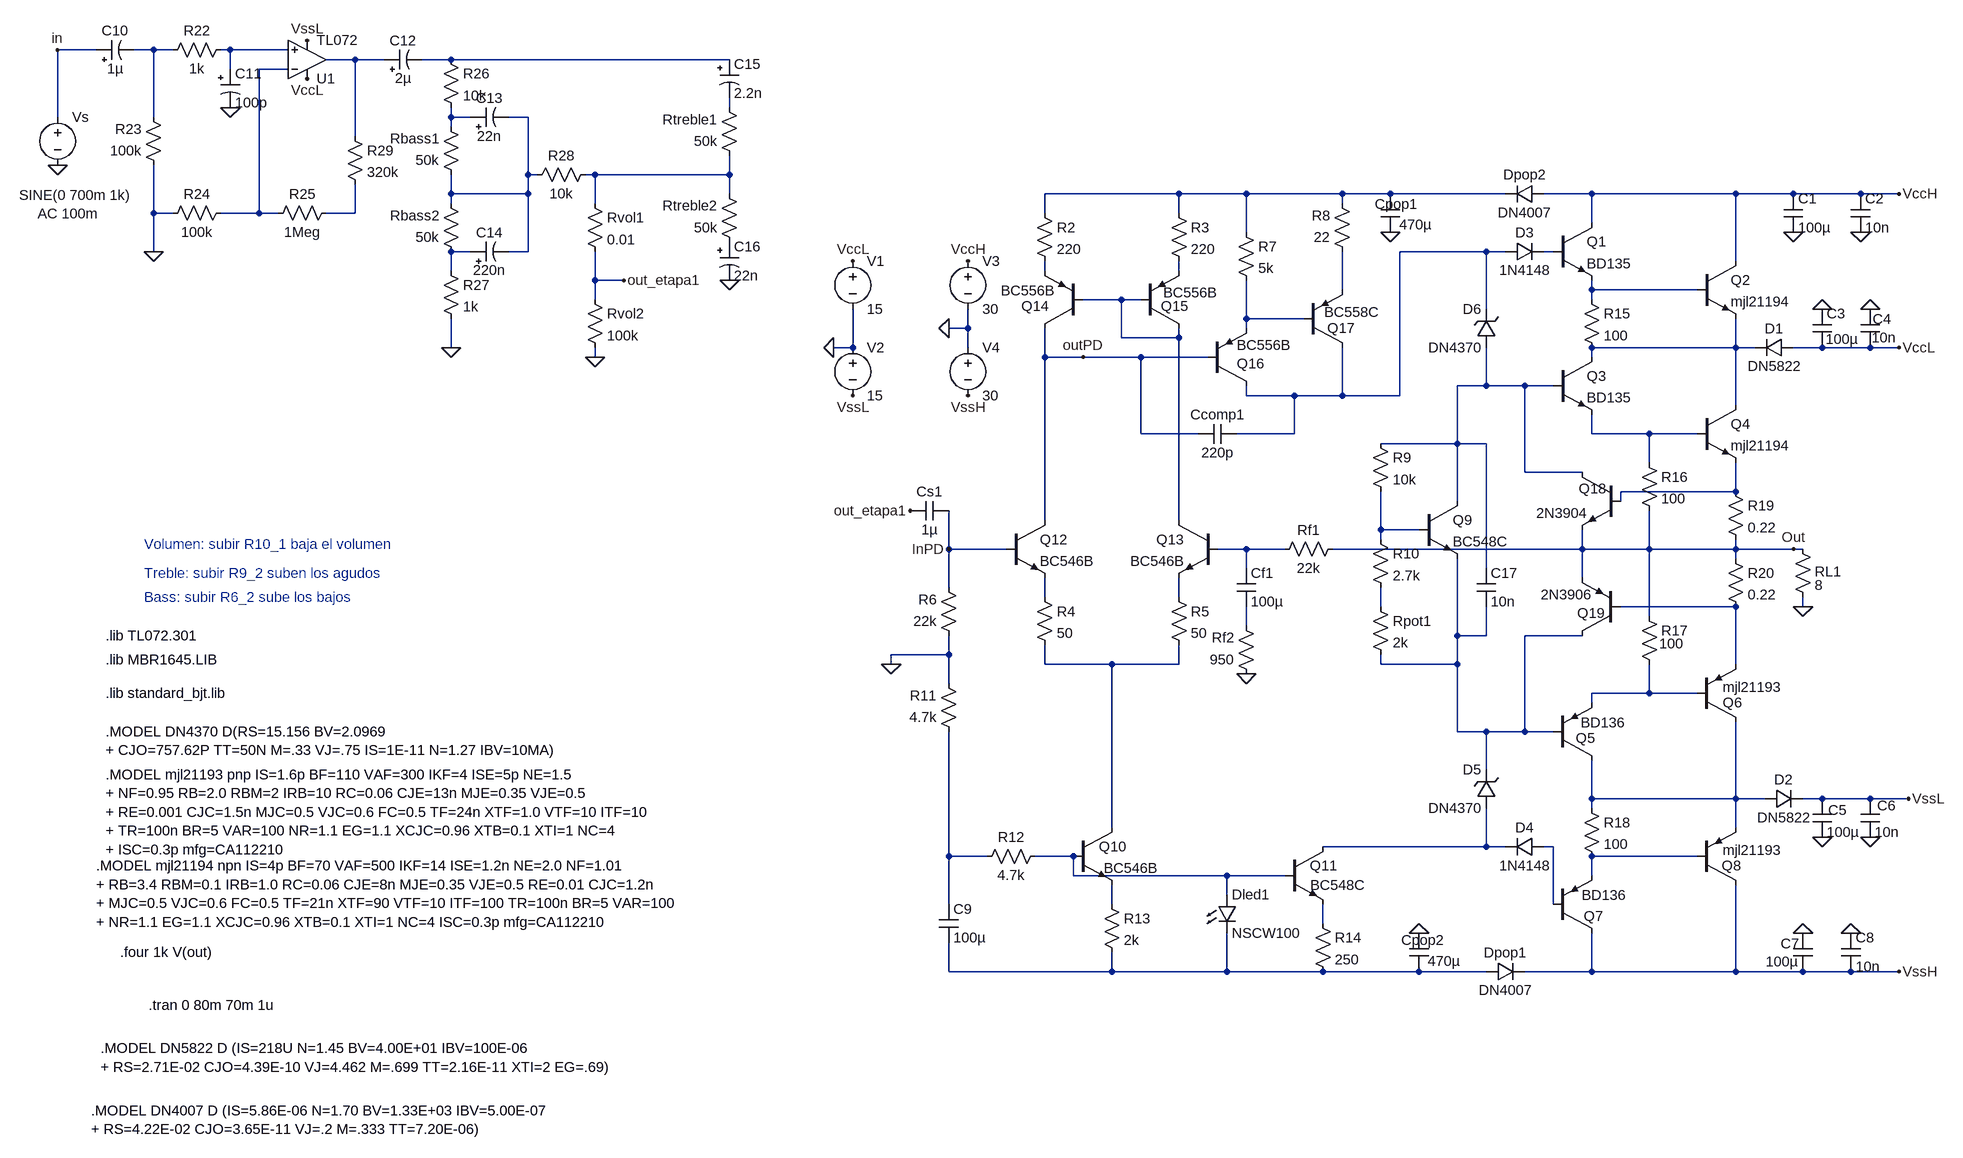
[diagram p0: schematic circuito_completo.asc]
circuito_completo.asc, the LTspice schematic file:
Version 4
SHEET 1 3596 1588
WIRE -736 -224 -800 -224
WIRE -640 -224 -672 -224
WIRE -608 -224 -640 -224
WIRE -512 -224 -528 -224
WIRE -416 -224 -512 -224
WIRE -304 -208 -352 -208
WIRE -256 -208 -304 -208
WIRE -144 -208 -192 -208
WIRE 320 -208 -144 -208
WIRE -512 -192 -512 -224
WIRE -416 -192 -464 -192
WIRE 320 -128 320 -144
WIRE -800 -112 -800 -224
WIRE -640 -112 -640 -224
WIRE -144 -112 -144 -128
WIRE -112 -112 -144 -112
WIRE -16 -112 -48 -112
WIRE -144 -96 -144 -112
WIRE -304 -80 -304 -208
WIRE -16 -16 -16 -112
WIRE 0 -16 -16 -16
WIRE 96 -16 80 -16
WIRE 320 -16 320 -48
WIRE 320 -16 96 -16
WIRE -144 16 -144 -16
WIRE -16 16 -16 -16
WIRE -16 16 -144 16
WIRE 320 16 320 -16
WIRE 1328 16 1104 16
WIRE 1440 16 1328 16
WIRE 1600 16 1440 16
WIRE 1680 16 1600 16
WIRE 1872 16 1680 16
WIRE 2016 16 1936 16
WIRE 2256 16 2016 16
WIRE 2352 16 2256 16
WIRE 2464 16 2352 16
WIRE 2528 16 2464 16
WIRE -144 32 -144 16
WIRE 96 32 96 -16
WIRE 1600 32 1600 16
WIRE -640 48 -640 -32
WIRE -608 48 -640 48
WIRE -464 48 -464 -192
WIRE -464 48 -528 48
WIRE -432 48 -464 48
WIRE -304 48 -304 0
WIRE -304 48 -352 48
WIRE 1104 48 1104 16
WIRE 1328 48 1328 16
WIRE 2016 64 2016 16
WIRE 1440 80 1440 16
WIRE -640 112 -640 48
WIRE -112 112 -144 112
WIRE -16 112 -16 16
WIRE -16 112 -48 112
WIRE 1840 112 1696 112
WIRE 1872 112 1840 112
WIRE 1952 112 1936 112
WIRE 2256 128 2256 16
WIRE -144 144 -144 112
WIRE 1104 144 1104 128
WIRE 1328 144 1328 128
WIRE 96 160 96 112
WIRE 144 160 96 160
WIRE 1600 176 1600 112
WIRE 2016 176 2016 160
WIRE 2192 176 2016 176
WIRE 96 192 96 160
WIRE 1232 192 1168 192
WIRE 1264 192 1232 192
WIRE 2016 192 2016 176
WIRE 1840 208 1840 112
WIRE 1440 224 1440 160
WIRE 1536 224 1440 224
WIRE 976 240 976 208
WIRE 976 240 944 240
WIRE 1440 240 1440 224
WIRE 1232 256 1232 192
WIRE 1328 256 1328 240
WIRE 1328 256 1232 256
WIRE -144 272 -144 224
WIRE 784 272 784 208
WIRE 784 272 752 272
WIRE 976 272 976 240
WIRE 2256 272 2256 224
WIRE 2256 272 2016 272
WIRE 2288 272 2256 272
WIRE 2400 272 2352 272
WIRE 2480 272 2400 272
WIRE 2528 272 2480 272
WIRE 96 288 96 272
WIRE 1104 288 1104 240
WIRE 1168 288 1104 288
WIRE 1264 288 1168 288
WIRE 1376 288 1264 288
WIRE 2016 288 2016 272
WIRE 1840 336 1840 272
WIRE 1840 336 1792 336
WIRE 1904 336 1840 336
WIRE 1952 336 1904 336
WIRE 1440 352 1440 336
WIRE 1520 352 1440 352
WIRE 1600 352 1600 272
WIRE 1600 352 1520 352
WIRE 1696 352 1696 112
WIRE 1696 352 1600 352
WIRE 2256 368 2256 272
WIRE 1264 416 1264 288
WIRE 1360 416 1264 416
WIRE 1520 416 1520 352
WIRE 1520 416 1424 416
WIRE 2016 416 2016 384
WIRE 2112 416 2016 416
WIRE 2192 416 2112 416
WIRE 1792 432 1792 336
WIRE 1792 432 1664 432
WIRE 1840 432 1792 432
WIRE 2112 464 2112 416
WIRE 1904 480 1904 336
WIRE 2000 480 1904 480
WIRE 2256 512 2256 464
WIRE 2256 512 2064 512
WIRE 1792 528 1792 432
WIRE 2064 528 2064 512
WIRE 1104 560 1104 288
WIRE 1328 560 1328 256
WIRE 1664 576 1664 512
WIRE 1728 576 1664 576
WIRE 1664 592 1664 576
WIRE 944 608 944 544
WIRE 1040 608 944 608
WIRE 1440 608 1392 608
WIRE 1504 608 1440 608
WIRE 2000 608 2000 576
WIRE 2000 608 1584 608
WIRE 2112 608 2112 544
WIRE 2112 608 2000 608
WIRE 2256 608 2256 592
WIRE 2256 608 2112 608
WIRE 2352 608 2256 608
WIRE 2368 608 2352 608
WIRE 2256 624 2256 608
WIRE 1440 640 1440 608
WIRE 1840 640 1840 432
WIRE 2000 656 2000 608
WIRE 944 672 944 608
WIRE 1104 688 1104 656
WIRE 1328 688 1328 656
WIRE 1664 704 1664 672
WIRE 2256 704 2064 704
WIRE 2368 704 2368 688
WIRE 2112 720 2112 608
WIRE 1440 736 1440 704
WIRE 1792 752 1792 624
WIRE 1840 752 1840 704
WIRE 1840 752 1792 752
WIRE 2000 752 1904 752
WIRE 944 784 944 752
WIRE 944 784 848 784
WIRE 848 800 848 784
WIRE 1104 800 1104 768
WIRE 1216 800 1104 800
WIRE 1328 800 1328 768
WIRE 1328 800 1216 800
WIRE 1664 800 1664 784
WIRE 1792 800 1792 752
WIRE 1792 800 1664 800
WIRE 2256 800 2256 704
WIRE 944 832 944 784
WIRE 2112 848 2112 800
WIRE 2112 848 2016 848
WIRE 2192 848 2112 848
WIRE 2016 864 2016 848
WIRE 1792 912 1792 800
WIRE 1840 912 1792 912
WIRE 1904 912 1904 752
WIRE 1904 912 1840 912
WIRE 1952 912 1904 912
WIRE 1840 976 1840 912
WIRE 2016 1024 2016 960
WIRE 2256 1024 2256 896
WIRE 2256 1024 2016 1024
WIRE 2304 1024 2256 1024
WIRE 2400 1024 2368 1024
WIRE 2480 1024 2400 1024
WIRE 2544 1024 2480 1024
WIRE 2016 1040 2016 1024
WIRE 1216 1072 1216 800
WIRE 2256 1072 2256 1024
WIRE 1840 1104 1840 1040
WIRE 1840 1104 1568 1104
WIRE 1872 1104 1840 1104
WIRE 1952 1104 1936 1104
WIRE 944 1120 944 912
WIRE 1008 1120 944 1120
WIRE 1152 1120 1088 1120
WIRE 2192 1120 2016 1120
WIRE 1152 1152 1152 1120
WIRE 1408 1152 1152 1152
WIRE 1504 1152 1408 1152
WIRE 2016 1152 2016 1120
WIRE 1408 1184 1408 1152
WIRE 944 1200 944 1120
WIRE 1216 1200 1216 1168
WIRE 1952 1200 1952 1104
WIRE 1568 1232 1568 1200
WIRE 944 1312 944 1264
WIRE 1216 1312 1216 1280
WIRE 1216 1312 944 1312
WIRE 1408 1312 1408 1248
WIRE 1408 1312 1216 1312
WIRE 1568 1312 1408 1312
WIRE 1728 1312 1568 1312
WIRE 1840 1312 1728 1312
WIRE 2016 1312 2016 1248
WIRE 2016 1312 1904 1312
WIRE 2256 1312 2256 1168
WIRE 2256 1312 2016 1312
WIRE 2368 1312 2256 1312
WIRE 2448 1312 2368 1312
WIRE 2528 1312 2448 1312
FLAG 752 272 0
FLAG 944 240 0
FLAG 976 128 VccH
FLAG 784 128 VccL
FLAG 976 352 VssH
FLAG 784 352 VssL
FLAG -800 -32 0
FLAG -144 272 0
FLAG -640 112 0
FLAG -384 -176 VccL
FLAG -384 -240 VssL
FLAG -512 -128 0
FLAG 96 288 0
FLAG 320 160 0
FLAG 144 160 out_etapa1
FLAG -800 -224 in
FLAG 2528 272 VccL
FLAG 2528 16 VccH
FLAG 2368 704 0
FLAG 2528 1312 VssH
FLAG 2352 608 Out
FLAG 1440 816 0
FLAG 848 800 0
FLAG 2544 1024 VssL
FLAG 944 608 InPD
FLAG 1680 80 0
FLAG 1728 1248 0
FLAG 2400 1088 0
FLAG 2368 1248 0
FLAG 2400 208 0
FLAG 2352 80 0
FLAG 2464 80 0
FLAG 2448 1248 0
FLAG 2480 208 0
FLAG 2480 1088 0
FLAG 1168 288 outPD
FLAG 880 544 out_etapa1
SYMBOL voltage 784 112 R0
WINDOW 123 0 0 Left 0
WINDOW 39 0 0 Left 0
SYMATTR InstName V1
SYMATTR Value 15
SYMBOL voltage 784 256 R0
WINDOW 123 0 0 Left 0
WINDOW 39 0 0 Left 0
SYMATTR InstName V2
SYMATTR Value 15
SYMBOL voltage 976 112 R0
WINDOW 123 0 0 Left 0
WINDOW 39 0 0 Left 0
SYMATTR InstName V3
SYMATTR Value 30
SYMBOL voltage 976 256 R0
WINDOW 123 0 0 Left 0
WINDOW 39 0 0 Left 0
SYMATTR InstName V4
SYMATTR Value 30
SYMBOL polcap -736 -208 R270
WINDOW 0 32 32 VTop 2
WINDOW 3 0 32 VBottom 2
SYMATTR InstName C10
SYMATTR Value 1µ
SYMBOL polcap -528 -192 R0
SYMATTR InstName C11
SYMATTR Value 100p
SYMBOL polcap -256 -192 R270
WINDOW 0 32 32 VTop 2
WINDOW 3 0 32 VBottom 2
SYMATTR InstName C12
SYMATTR Value 2µ
SYMBOL polcap -112 -96 R270
WINDOW 0 32 32 VTop 2
WINDOW 3 0 32 VBottom 2
SYMATTR InstName C13
SYMATTR Value 22n
SYMBOL polcap -112 128 R270
WINDOW 0 32 32 VTop 2
WINDOW 3 0 32 VBottom 2
SYMATTR InstName C14
SYMATTR Value 220n
SYMBOL polcap 304 -208 R0
SYMATTR InstName C15
SYMATTR Value 2.2n
SYMBOL polcap 304 96 R0
SYMATTR InstName C16
SYMATTR Value 22n
SYMBOL res -512 -240 R90
WINDOW 0 0 56 VBottom 2
WINDOW 3 32 56 VTop 2
SYMATTR InstName R22
SYMATTR Value 1k
SYMBOL res -624 -16 R180
WINDOW 0 36 76 Left 2
WINDOW 3 36 40 Left 2
SYMATTR InstName R23
SYMATTR Value 100k
SYMBOL res -624 64 R270
WINDOW 0 32 56 VTop 2
WINDOW 3 0 56 VBottom 2
SYMATTR InstName R24
SYMATTR Value 100k
SYMBOL res -448 64 R270
WINDOW 0 32 56 VTop 2
WINDOW 3 0 56 VBottom 2
SYMATTR InstName R25
SYMATTR Value 1Meg
SYMBOL res -160 -224 R0
SYMATTR InstName R26
SYMATTR Value 10k
SYMBOL res -128 128 R180
WINDOW 0 36 76 Left 2
WINDOW 3 36 40 Left 2
SYMATTR InstName Rbass2
SYMATTR Value 50k
SYMBOL res -160 128 R0
SYMATTR InstName R27
SYMATTR Value 1k
SYMBOL res 96 -32 R90
WINDOW 0 0 56 VBottom 2
WINDOW 3 32 56 VTop 2
SYMATTR InstName R28
SYMATTR Value 10k
SYMBOL res 336 -32 R180
WINDOW 0 36 76 Left 2
WINDOW 3 36 40 Left 2
SYMATTR InstName Rtreble1
SYMATTR Value 50k
SYMBOL res 80 16 R0
SYMATTR InstName Rvol1
SYMATTR Value 0.01
SYMBOL voltage -800 -128 R0
WINDOW 123 -33 177 Left 2
WINDOW 39 0 0 Left 0
WINDOW 3 -64 146 Left 2
SYMATTR Value2 AC 100m
SYMATTR Value SINE(0 700m 1k)
SYMATTR InstName Vs
SYMBOL Opamps\\opamp2 -384 -144 M180
SYMATTR InstName U1
SYMATTR Value TL072
SYMBOL res -128 0 R180
WINDOW 0 36 76 Left 2
WINDOW 3 36 40 Left 2
SYMATTR InstName Rbass1
SYMATTR Value 50k
SYMBOL res 336 112 R180
WINDOW 0 36 76 Left 2
WINDOW 3 36 40 Left 2
SYMATTR InstName Rtreble2
SYMATTR Value 50k
SYMBOL res 80 176 R0
SYMATTR InstName Rvol2
SYMATTR Value 100k
SYMBOL res 2352 592 R0
WINDOW 0 36 54 Left 2
SYMATTR InstName RL1
SYMATTR Value 8
SYMBOL diode 1872 128 R270
WINDOW 0 32 32 VTop 2
WINDOW 3 0 32 VBottom 2
SYMATTR InstName D3
SYMATTR Value 1N4148
SYMBOL diode 1936 1088 R90
WINDOW 0 0 32 VBottom 2
WINDOW 3 32 32 VTop 2
SYMATTR InstName D4
SYMATTR Value 1N4148
SYMBOL npn 1728 528 R0
SYMATTR InstName Q9
SYMATTR Value BC548C
SYMBOL res 1648 416 R0
SYMATTR InstName R9
SYMATTR Value 10k
SYMBOL res 1648 576 R0
SYMATTR InstName R10
SYMATTR Value 2.7k
SYMBOL npn 1504 1104 R0
WINDOW 0 42 32 Left 2
WINDOW 3 43 64 Left 2
SYMATTR InstName Q11
SYMATTR Value BC548C
SYMBOL res 1552 1216 R0
SYMATTR InstName R14
SYMATTR Value 250
SYMBOL npn 1392 560 M0
SYMATTR InstName Q13
SYMATTR Value BC546B
SYMBOL res 1600 592 R90
WINDOW 0 0 56 VBottom 2
WINDOW 3 32 56 VTop 2
SYMATTR InstName Rf1
SYMATTR Value 22k
SYMBOL res 1456 832 R180
WINDOW 0 36 76 Left 2
WINDOW 3 36 40 Left 2
SYMATTR InstName Rf2
SYMATTR Value 950
SYMBOL cap 1424 640 R0
SYMATTR InstName Cf1
SYMATTR Value 100µ
SYMBOL npn 1040 560 R0
SYMATTR InstName Q12
SYMATTR Value BC546B
SYMBOL npn 1152 1072 R0
WINDOW 0 42 32 Left 2
WINDOW 3 51 68 Left 2
SYMATTR InstName Q10
SYMATTR Value BC546B
SYMBOL res 1200 1184 R0
SYMATTR InstName R13
SYMATTR Value 2k
SYMBOL res 1104 1104 R90
WINDOW 0 0 56 VBottom 2
WINDOW 3 32 56 VTop 2
SYMATTR InstName R12
SYMATTR Value 4.7k
SYMBOL res 960 768 R180
WINDOW 0 36 76 Left 2
WINDOW 3 36 40 Left 2
SYMATTR InstName R6
SYMATTR Value 22k
SYMBOL res 960 928 R180
WINDOW 0 36 76 Left 2
WINDOW 3 36 40 Left 2
SYMATTR InstName R11
SYMATTR Value 4.7k
SYMBOL cap 928 1200 R0
SYMATTR InstName C9
SYMATTR Value 100µ
SYMBOL cap 944 528 R90
WINDOW 0 0 32 VBottom 2
WINDOW 3 32 32 VTop 2
SYMATTR InstName Cs1
SYMATTR Value 1µ
SYMBOL pnp 1168 240 R180
WINDOW 0 57 37 Left 2
WINDOW 3 48 63 Left 2
SYMATTR InstName Q14
SYMATTR Value BC556B
SYMBOL pnp 1264 240 M180
WINDOW 0 34 37 Left 2
WINDOW 3 38 59 Left 2
SYMATTR InstName Q15
SYMATTR Value BC556B
SYMBOL res 1424 64 R0
SYMATTR InstName R7
SYMATTR Value 5k
SYMBOL pnp 1376 336 M180
WINDOW 0 48 37 Left 2
WINDOW 3 48 68 Left 2
SYMATTR InstName Q16
SYMATTR Value BC556B
SYMBOL zener 1856 1040 R180
WINDOW 0 24 64 Left 2
WINDOW 3 24 0 Left 2
SYMATTR InstName D5
SYMATTR Value DN4370
SYMBOL zener 1856 272 R180
WINDOW 0 24 64 Left 2
WINDOW 3 24 0 Left 2
SYMATTR InstName D6
SYMATTR Value DN4370
SYMBOL LED 1392 1184 R0
SYMATTR InstName Dled1
SYMATTR Value NSCW100
SYMBOL res 1616 128 R180
WINDOW 0 36 76 Left 2
WINDOW 3 36 40 Left 2
SYMATTR InstName R8
SYMATTR Value 22
SYMBOL pnp 1536 272 M180
WINDOW 0 39 32 Left 2
WINDOW 3 34 59 Left 2
SYMATTR InstName Q17
SYMATTR Value BC558C
SYMBOL cap 1424 400 R90
WINDOW 0 0 32 VBottom 2
WINDOW 3 32 32 VTop 2
SYMATTR InstName Ccomp1
SYMATTR Value 220p
SYMBOL diode 1840 1328 R270
WINDOW 0 32 32 VTop 2
WINDOW 3 0 32 VBottom 2
SYMATTR InstName Dpop1
SYMATTR Value DN4007
SYMBOL diode 1936 0 R90
WINDOW 0 0 32 VBottom 2
WINDOW 3 32 32 VTop 2
SYMATTR InstName Dpop2
SYMATTR Value DN4007
SYMBOL cap 1696 80 R180
WINDOW 0 -30 47 Left 2
WINDOW 3 -53 13 Left 2
SYMATTR InstName Cpop1
SYMATTR Value 470µ
SYMBOL cap 1744 1312 R180
WINDOW 0 -26 52 Left 2
WINDOW 3 -53 17 Left 2
SYMATTR InstName Cpop2
SYMATTR Value 470µ
SYMBOL cap 2352 1248 R0
WINDOW 0 -21 18 Left 2
WINDOW 3 -46 48 Left 2
SYMATTR InstName C7
SYMATTR Value 100µ
SYMBOL cap 2336 16 R0
SYMATTR InstName C1
SYMATTR Value 100µ
SYMBOL cap 2384 208 R0
WINDOW 3 22 50 Left 2
SYMATTR Value 100µ
SYMATTR InstName C3
SYMBOL cap 2384 1024 R0
WINDOW 0 26 19 Left 2
SYMATTR InstName C5
SYMATTR Value 100µ
SYMBOL res 1088 32 R0
SYMATTR InstName R2
SYMATTR Value 220
SYMBOL res 1312 32 R0
SYMATTR InstName R3
SYMATTR Value 220
SYMBOL cap 2448 16 R0
SYMATTR InstName C2
SYMATTR Value 10n
SYMBOL cap 2432 1248 R0
SYMATTR InstName C8
SYMATTR Value 10n
SYMBOL cap 2464 208 R0
WINDOW 0 20 17 Left 2
WINDOW 3 19 48 Left 2
SYMATTR InstName C4
SYMATTR Value 10n
SYMBOL cap 2464 1024 R0
WINDOW 0 28 12 Left 2
SYMATTR InstName C6
SYMATTR Value 10n
SYMBOL diode 2304 1040 R270
WINDOW 0 32 32 VTop 2
WINDOW 3 0 32 VBottom 2
SYMATTR InstName D2
SYMATTR Value DN5822
SYMBOL diode 2352 256 R90
WINDOW 0 0 32 VBottom 2
WINDOW 3 32 32 VTop 2
SYMATTR InstName D1
SYMATTR Value DN5822
SYMBOL npn 2064 480 M0
WINDOW 0 24 27 Left 2
SYMATTR InstName Q18
SYMATTR Value 2N3904
SYMBOL pnp 2064 752 R180
WINDOW 0 26 37 Left 2
WINDOW 3 48 68 Left 2
SYMATTR InstName Q19
SYMATTR Value 2N3906
SYMBOL res 1088 672 R0
SYMATTR InstName R4
SYMATTR Value 50
SYMBOL res 1312 672 R0
SYMATTR InstName R5
SYMATTR Value 50
SYMBOL res 2240 608 R0
SYMATTR InstName R20
SYMATTR Value 0.22
SYMBOL res 2240 496 R0
SYMATTR InstName R19
SYMATTR Value 0.22
SYMBOL npn 1952 288 R0
SYMATTR InstName Q3
SYMATTR Value BD135
SYMBOL npn 2192 368 R0
SYMATTR InstName Q4
SYMATTR Value mjl21194
SYMBOL npn 1952 64 R0
SYMATTR InstName Q1
SYMATTR Value BD135
SYMBOL npn 2192 128 R0
SYMATTR InstName Q2
SYMATTR Value mjl21194
SYMBOL pnp 2192 896 M180
WINDOW 0 42 32 Left 2
WINDOW 3 42 58 Left 2
SYMATTR InstName Q6
SYMATTR Value mjl21193
SYMBOL pnp 1952 960 M180
WINDOW 0 37 37 Left 2
WINDOW 3 46 63 Left 2
SYMATTR InstName Q5
SYMATTR Value BD136
SYMBOL pnp 2192 1168 M180
WINDOW 0 41 32 Left 2
WINDOW 3 42 58 Left 2
SYMATTR InstName Q8
SYMATTR Value mjl21193
SYMBOL pnp 1952 1248 M180
WINDOW 0 51 28 Left 2
WINDOW 3 47 63 Left 2
SYMATTR InstName Q7
SYMATTR Value BD136
SYMBOL res 2000 1024 R0
SYMATTR InstName R18
SYMATTR Value 100
SYMBOL res 2096 704 R0
WINDOW 3 73 62 Right 2
SYMATTR Value 100
SYMATTR InstName R17
SYMBOL res 2096 448 R0
SYMATTR InstName R16
SYMATTR Value 100
SYMBOL res 2000 176 R0
SYMATTR InstName R15
SYMATTR Value 100
SYMBOL res 1648 688 R0
SYMATTR InstName Rpot1
SYMATTR Value 2k
SYMBOL cap 1824 640 R0
SYMATTR InstName C17
SYMATTR Value 10n
SYMBOL res -320 -96 R0
SYMATTR InstName R29
SYMATTR Value 320k
TEXT -720 848 Left 2 !.lib standard_bjt.lib
TEXT -648 1368 Left 2 !.tran 0 80m 70m 1u
TEXT -720 792 Left 2 !.lib MBR1645.LIB
TEXT -720 752 Left 2 !.lib TL072.301
TEXT -656 600 Left 2 ;Volumen: subir R10_1 baja el volumen
TEXT -656 648 Left 2 ;Treble: subir R9_2 suben los agudos
TEXT -656 688 Left 2 ;Bass: subir R6_2 sube los bajos
TEXT -720 984 Left 2 !.MODEL mjl21193 pnp IS=1.6p BF=110 VAF=300 IKF=4 ISE=5p NE=1.5\n+ NF=0.95 RB=2.0 RBM=2 IRB=10 RC=0.06 CJE=13n MJE=0.35 VJE=0.5\n+ RE=0.001 CJC=1.5n MJC=0.5 VJC=0.6 FC=0.5 TF=24n XTF=1.0 VTF=10 ITF=10\n+ TR=100n BR=5 VAR=100 NR=1.1 EG=1.1 XCJC=0.96 XTB=0.1 XTI=1 NC=4\n+ ISC=0.3p mfg=CA112210
TEXT -736 1136 Left 2 !.MODEL mjl21194 npn IS=4p BF=70 VAF=500 IKF=14 ISE=1.2n NE=2.0 NF=1.01\n+ RB=3.4 RBM=0.1 IRB=1.0 RC=0.06 CJE=8n MJE=0.35 VJE=0.5 RE=0.01 CJC=1.2n\n+ MJC=0.5 VJC=0.6 FC=0.5 TF=21n XTF=90 VTF=10 ITF=100 TR=100n BR=5 VAR=100\n+ NR=1.1 EG=1.1 XCJC=0.96 XTB=0.1 XTI=1 NC=4 ISC=0.3p mfg=CA112210
TEXT -720 912 Left 2 !.MODEL DN4370 D(RS=15.156 BV=2.0969     \n+ CJO=757.62P TT=50N M=.33 VJ=.75 IS=1E-11 N=1.27 IBV=10MA)
TEXT -696 1280 Left 2 !.four 1k V(out)
TEXT -728 1440 Left 2 !.MODEL DN5822 D (IS=218U N=1.45 BV=4.00E+01 IBV=100E-06\n+ RS=2.71E-02 CJO=4.39E-10 VJ=4.462 M=.699 TT=2.16E-11 XTI=2 EG=.69)
TEXT -744 1544 Left 2 !.MODEL DN4007 D (IS=5.86E-06 N=1.70 BV=1.33E+03 IBV=5.00E-07\n+ RS=4.22E-02 CJO=3.65E-11 VJ=.2 M=.333 TT=7.20E-06)

The netlist it stands for:
* circuito_completo.asc
V1 VccL 0 15
V2 0 VssL 15
V3 VccH 0 30
V4 0 VssH 30
C10 in N001 1µ
C11 N002 0 100p
C12 N003 N004 2µ
C13 N007 N008 22n
C14 N012 N008 220n
C15 N004 N006 2.2n
C16 P001 0 22n
R22 N002 N001 1k
R23 0 N001 100k
R24 0 N005 100k
R25 N005 N011 1Meg
R26 N004 N007 10k
Rbass2 N012 N008 50k
R27 N012 0 1k
R28 N009 N008 10k
Rtreble1 N009 N006 50k
Rvol1 N009 out_etapa1 0.01
Vs in 0 SINE(0 700m 1k) AC 100m
XU1 N002 N005 VccL VssL N003 TL072  ; pins In+ In- V+ V- OUT
Rbass1 N008 N007 50k
Rtreble2 P001 N009 50k
Rvol2 out_etapa1 0 100k
RL1 Out 0 8
D3 N013 N014 1N4148
D4 N037 N036 1N4148
Q9 N022 N025 N032 0 BC548C
R9 N022 N025 10k
R10 N025 N029 2.7k
Q11 N036 N039 N042 0 BC548C
R14 N042 N043 250
Q13 N019 N026 N028 0 BC546B
Rf1 Out N026 22k
Rf2 0 N031 950
Cf1 N026 N031 100µ
Q12 outPD InPD N027 0 BC546B
Q10 N033 N039 N041 0 BC546B
R13 N041 N043 2k
R12 N039 N038 4.7k
R6 0 InPD 22k
R11 N038 0 4.7k
C9 N038 N043 100µ
Cs1 InPD out_etapa1 1µ
Q14 outPD N019 N015 0 BC556B
Q15 N019 N019 N016 0 BC556B
R7 N010 N020 5k
Q16 N013 outPD N020 0 BC556B
D5 N036 N032 DN4370
D6 N022 N013 DN4370
Dled1 N039 N043 NSCW100
R8 N017 N010 22
Q17 N013 N020 N017 0 BC558C
Ccomp1 N013 outPD 220p
Dpop1 N043 VssH DN4007
Dpop2 VccH N010 DN4007
Cpop1 0 N010 470µ
Cpop2 N043 0 470µ
C7 0 VssH 100µ
C1 VccH 0 100µ
C3 0 VccL 100µ
C5 VssL 0 100µ
R2 N010 N015 220
R3 N010 N016 220
C2 VccH 0 10n
C8 0 VssH 10n
C4 0 VccL 10n
C6 VssL 0 10n
D2 N035 VssL DN5822
D1 VccL N021 DN5822
Q18 N022 N024 Out 0 2N3904
Q19 N032 N030 Out 0 2N3906
R4 N027 N033 50
R5 N028 N033 50
R20 Out N030 0.22
R19 N024 Out 0.22
Q3 N021 N022 N023 0 BD135
Q4 N021 N023 N024 0 mjl21194
Q1 VccH N014 N018 0 BD135
Q2 VccH N018 N021 0 mjl21194
Q6 N035 N034 N030 0 mjl21193
Q5 N035 N032 N034 0 BD136
Q8 VssH N040 N035 0 mjl21193
Q7 VssH N037 N040 0 BD136
R18 N035 N040 100
R17 Out N034 100
R16 N023 Out 100
R15 N018 N021 100
Rpot1 N029 N032 2k
C17 N022 N032 10n
R29 N003 N011 320k
.model D D
.lib standard.dio
.model NPN NPN
.model PNP PNP
.lib standard.bjt
.lib standard_bjt.lib
.tran 0 80m 70m 1u
.lib MBR1645.LIB
.lib TL072.301
* Volumen: subir R10_1 baja el volumen
* Treble: subir R9_2 suben los agudos
* Bass: subir R6_2 sube los bajos
.MODEL mjl21193 pnp IS=1.6p BF=110 VAF=300 IKF=4 ISE=5p NE=1.5
+ NF=0.95 RB=2.0 RBM=2 IRB=10 RC=0.06 CJE=13n MJE=0.35 VJE=0.5
+ RE=0.001 CJC=1.5n MJC=0.5 VJC=0.6 FC=0.5 TF=24n XTF=1.0 VTF=10 ITF=10
+ TR=100n BR=5 VAR=100 NR=1.1 EG=1.1 XCJC=0.96 XTB=0.1 XTI=1 NC=4
+ ISC=0.3p mfg=CA112210
.MODEL mjl21194 npn IS=4p BF=70 VAF=500 IKF=14 ISE=1.2n NE=2.0 NF=1.01
+ RB=3.4 RBM=0.1 IRB=1.0 RC=0.06 CJE=8n MJE=0.35 VJE=0.5 RE=0.01 CJC=1.2n
+ MJC=0.5 VJC=0.6 FC=0.5 TF=21n XTF=90 VTF=10 ITF=100 TR=100n BR=5 VAR=100
+ NR=1.1 EG=1.1 XCJC=0.96 XTB=0.1 XTI=1 NC=4 ISC=0.3p mfg=CA112210
.MODEL DN4370 D(RS=15.156 BV=2.0969
+ CJO=757.62P TT=50N M=.33 VJ=.75 IS=1E-11 N=1.27 IBV=10MA)
.four 1k V(out)
.MODEL DN5822 D (IS=218U N=1.45 BV=4.00E+01 IBV=100E-06
+ RS=2.71E-02 CJO=4.39E-10 VJ=4.462 M=.699 TT=2.16E-11 XTI=2 EG=.69)
.MODEL DN4007 D (IS=5.86E-06 N=1.70 BV=1.33E+03 IBV=5.00E-07
+ RS=4.22E-02 CJO=3.65E-11 VJ=.2 M=.333 TT=7.20E-06)
.backanno
.end